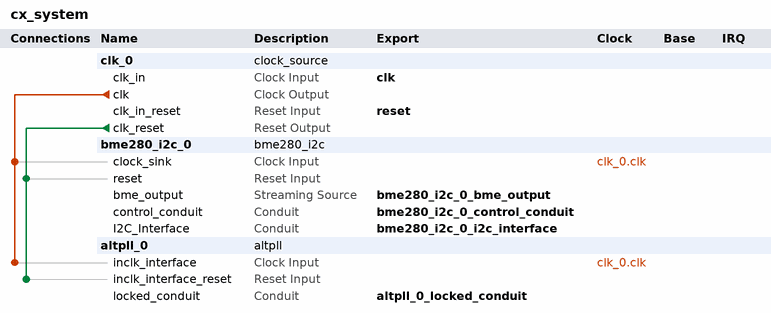
[diagram p0: system contents]
# Platform Designer (Qsys) system cx_system, MAX 10 10M08SAE144C8GES
# Parameters at their usual value, and those the tool derives, are not listed.
package require -exact qsys 18.0
create_system cx_system
set_project_property DEVICE_FAMILY {MAX 10}
set_project_property DEVICE 10M08SAE144C8GES

add_instance clk_0 clock_source 18.0
set_instance_parameter_value clk_0 clockFrequency 50000000

add_instance bme280_i2c_0 bme280_i2c 1.0
set_instance_parameter_value bme280_i2c_0 input_clk 50000000
set_instance_parameter_value bme280_i2c_0 reads_per_second 16
set_instance_parameter_value bme280_i2c_0 sdo 0

add_instance altpll_0 altpll 18.0
set_instance_parameter_value altpll_0 CLK0_DIVIDE_BY 3125
set_instance_parameter_value altpll_0 CLK0_MULTIPLY_BY 768
set_instance_parameter_value altpll_0 CLK1_DIVIDE_BY 3125
set_instance_parameter_value altpll_0 CLK1_DUTY_CYCLE 50
set_instance_parameter_value altpll_0 CLK1_MULTIPLY_BY 768
set_instance_parameter_value altpll_0 CLK1_PHASE_SHIFT 0
set_instance_parameter_value altpll_0 CLK2_DIVIDE_BY 2
set_instance_parameter_value altpll_0 CLK2_DUTY_CYCLE 50
set_instance_parameter_value altpll_0 CLK2_MULTIPLY_BY 1
set_instance_parameter_value altpll_0 CLK2_PHASE_SHIFT 0
set_instance_parameter_value altpll_0 INCLK0_INPUT_FREQUENCY 20000
set_instance_parameter_value altpll_0 PORT_ARESET PORT_UNUSED
set_instance_parameter_value altpll_0 PORT_LOCKED PORT_USED
set_instance_parameter_value altpll_0 PORT_clk1 PORT_USED
set_instance_parameter_value altpll_0 PORT_clk2 PORT_USED
set_instance_parameter_value altpll_0 PORT_clk3 PORT_UNUSED

# connections
add_connection clk_0.clk altpll_0.inclk_interface clock
add_connection clk_0.clk bme280_i2c_0.clock_sink clock
add_connection clk_0.clk_reset altpll_0.inclk_interface_reset reset
add_connection clk_0.clk_reset bme280_i2c_0.reset reset

# exported interfaces
add_interface altpll_0_locked_conduit conduit end
set_interface_property altpll_0_locked_conduit EXPORT_OF altpll_0.locked_conduit
add_interface bme280_i2c_0_bme_output avalon_streaming source
set_interface_property bme280_i2c_0_bme_output EXPORT_OF bme280_i2c_0.bme_output
add_interface bme280_i2c_0_control_conduit conduit end
set_interface_property bme280_i2c_0_control_conduit EXPORT_OF bme280_i2c_0.control_conduit
add_interface bme280_i2c_0_i2c_interface conduit end
set_interface_property bme280_i2c_0_i2c_interface EXPORT_OF bme280_i2c_0.I2C_Interface
add_interface clk clock sink
set_interface_property clk EXPORT_OF clk_0.clk_in
add_interface reset reset sink
set_interface_property reset EXPORT_OF clk_0.clk_in_reset

set_interconnect_requirement {$system} qsys_mm.clockCrossingAdapter HANDSHAKE
set_interconnect_requirement {$system} qsys_mm.enableEccProtection FALSE
set_interconnect_requirement {$system} qsys_mm.insertDefaultSlave FALSE
set_interconnect_requirement {$system} qsys_mm.maxAdditionalLatency 1

save_system cx_system.qsys
